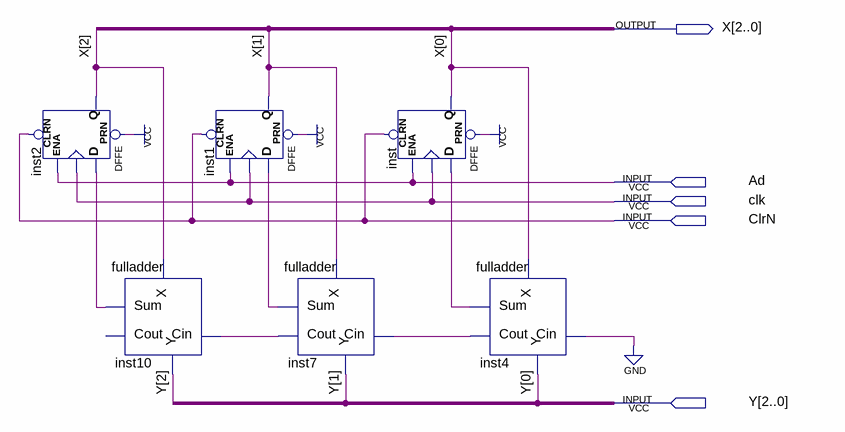
[diagram p0: schematic sheet]
// Quartus schematic FAwAcc.bdf as structural Verilog: 6 symbols, 5 pins
module FAwAcc (
  input  Ad,
  input  clk,
  input  ClrN,
  input  [2:0] Y,
  output [2:0] X
);

  wire inst4_cout, inst4_sum, inst7_cout, inst7_sum, inst10_sum;

  DFFE inst2 (.PRN(1'b1), .CLRN(ClrN), .D(inst10_sum), .CLK(clk), .ENA(Ad), .Q(X[2]));
  fulladder inst10 (.X(X[2]), .Y(Y[2]), .Cin(inst7_cout), .Sum(inst10_sum));  // open: Cout
  DFFE inst1 (.PRN(1'b1), .CLRN(ClrN), .D(inst7_sum), .CLK(clk), .ENA(Ad), .Q(X[1]));
  fulladder inst7 (.X(X[1]), .Y(Y[1]), .Cin(inst4_cout), .Cout(inst7_cout), .Sum(inst7_sum));
  DFFE inst (.PRN(1'b1), .CLRN(ClrN), .D(inst4_sum), .CLK(clk), .ENA(Ad), .Q(X[0]));
  fulladder inst4 (.X(X[0]), .Y(Y[0]), .Cin(1'b0), .Cout(inst4_cout), .Sum(inst4_sum));
endmodule
